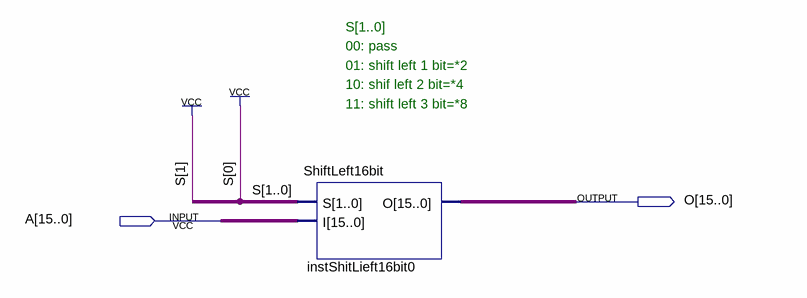
[diagram p0: schematic sheet]
// Quartus schematic Multi8.bdf as structural Verilog: 1 symbols, 2 pins
module Multi8 (
  input  [15:0] A,
  output [15:0] O
);

  ShiftLeft16bit instShitLieft16bit0 (.S(2'b11), .I(A), .O(O));

  // Notes on the sheet:
  //   S[1..0]
  //   00: pass
  //   01: shift left 1 bit=*2
  //   10: shif left 2 bit=*4
  //   11: shift left 3 bit=*8
endmodule
